# Altium schematic sheet ground_detector.SchDoc
size A4
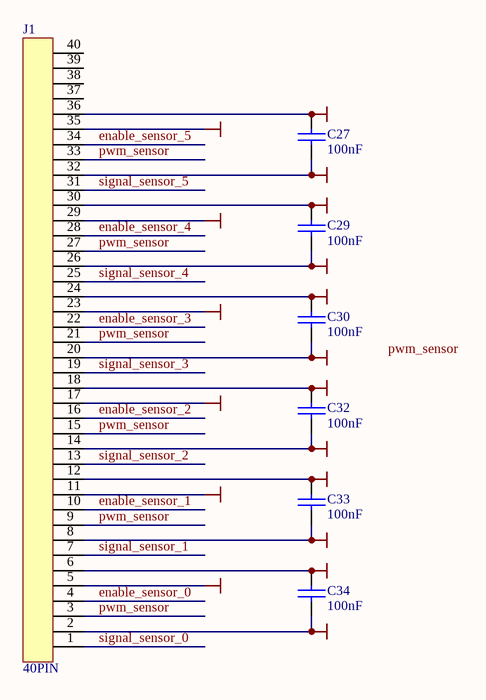
[diagram p0: ground_detector.SchDoc]

## Parts
C27  100nF  [TCONDO]
C29  100nF  [TCONDO]
C30  100nF  [TCONDO]
C32  100nF  [TCONDO]
C33  100nF  [TCONDO]
C34  100nF  [TCONDO]
J1  40PIN  [HE10-40V]

## Nets
3V3: C27.1 C29.1 C30.1 C32.1 C33.1 C34.1 J1.6 J1.12 J1.18 J1.24 J1.30 J1.36
GND: C27.2 C29.2 C30.2 C32.2 C33.2 C34.2 J1.2 J1.5 J1.8 J1.11 J1.14 J1.17 J1.20 J1.23 J1.26 J1.29 J1.32 J1.35
enable_sensor_0: J1.4
enable_sensor_1: J1.10
enable_sensor_2: J1.16
enable_sensor_3: J1.22
enable_sensor_4: J1.28
enable_sensor_5: J1.34
pwm_sensor: J1.3 J1.9 J1.15 J1.21 J1.27 J1.33
signal_sensor_0: J1.1
signal_sensor_1: J1.7
signal_sensor_2: J1.13
signal_sensor_3: J1.19
signal_sensor_4: J1.25
signal_sensor_5: J1.31

Not connected (* = marked no-connect by the designer): J1 37 38 39 40

## Notes on the sheet
- Labels drawn without touching a wire or pin: pwm_sensor

## Library data of the parts
C27 C29 C30 C32-C34 = TCONDO